# Altium schematic sheet Power_BZ_LED_HD.SchDoc
size A3; SheetNumber: 5; SheetTotal: 6
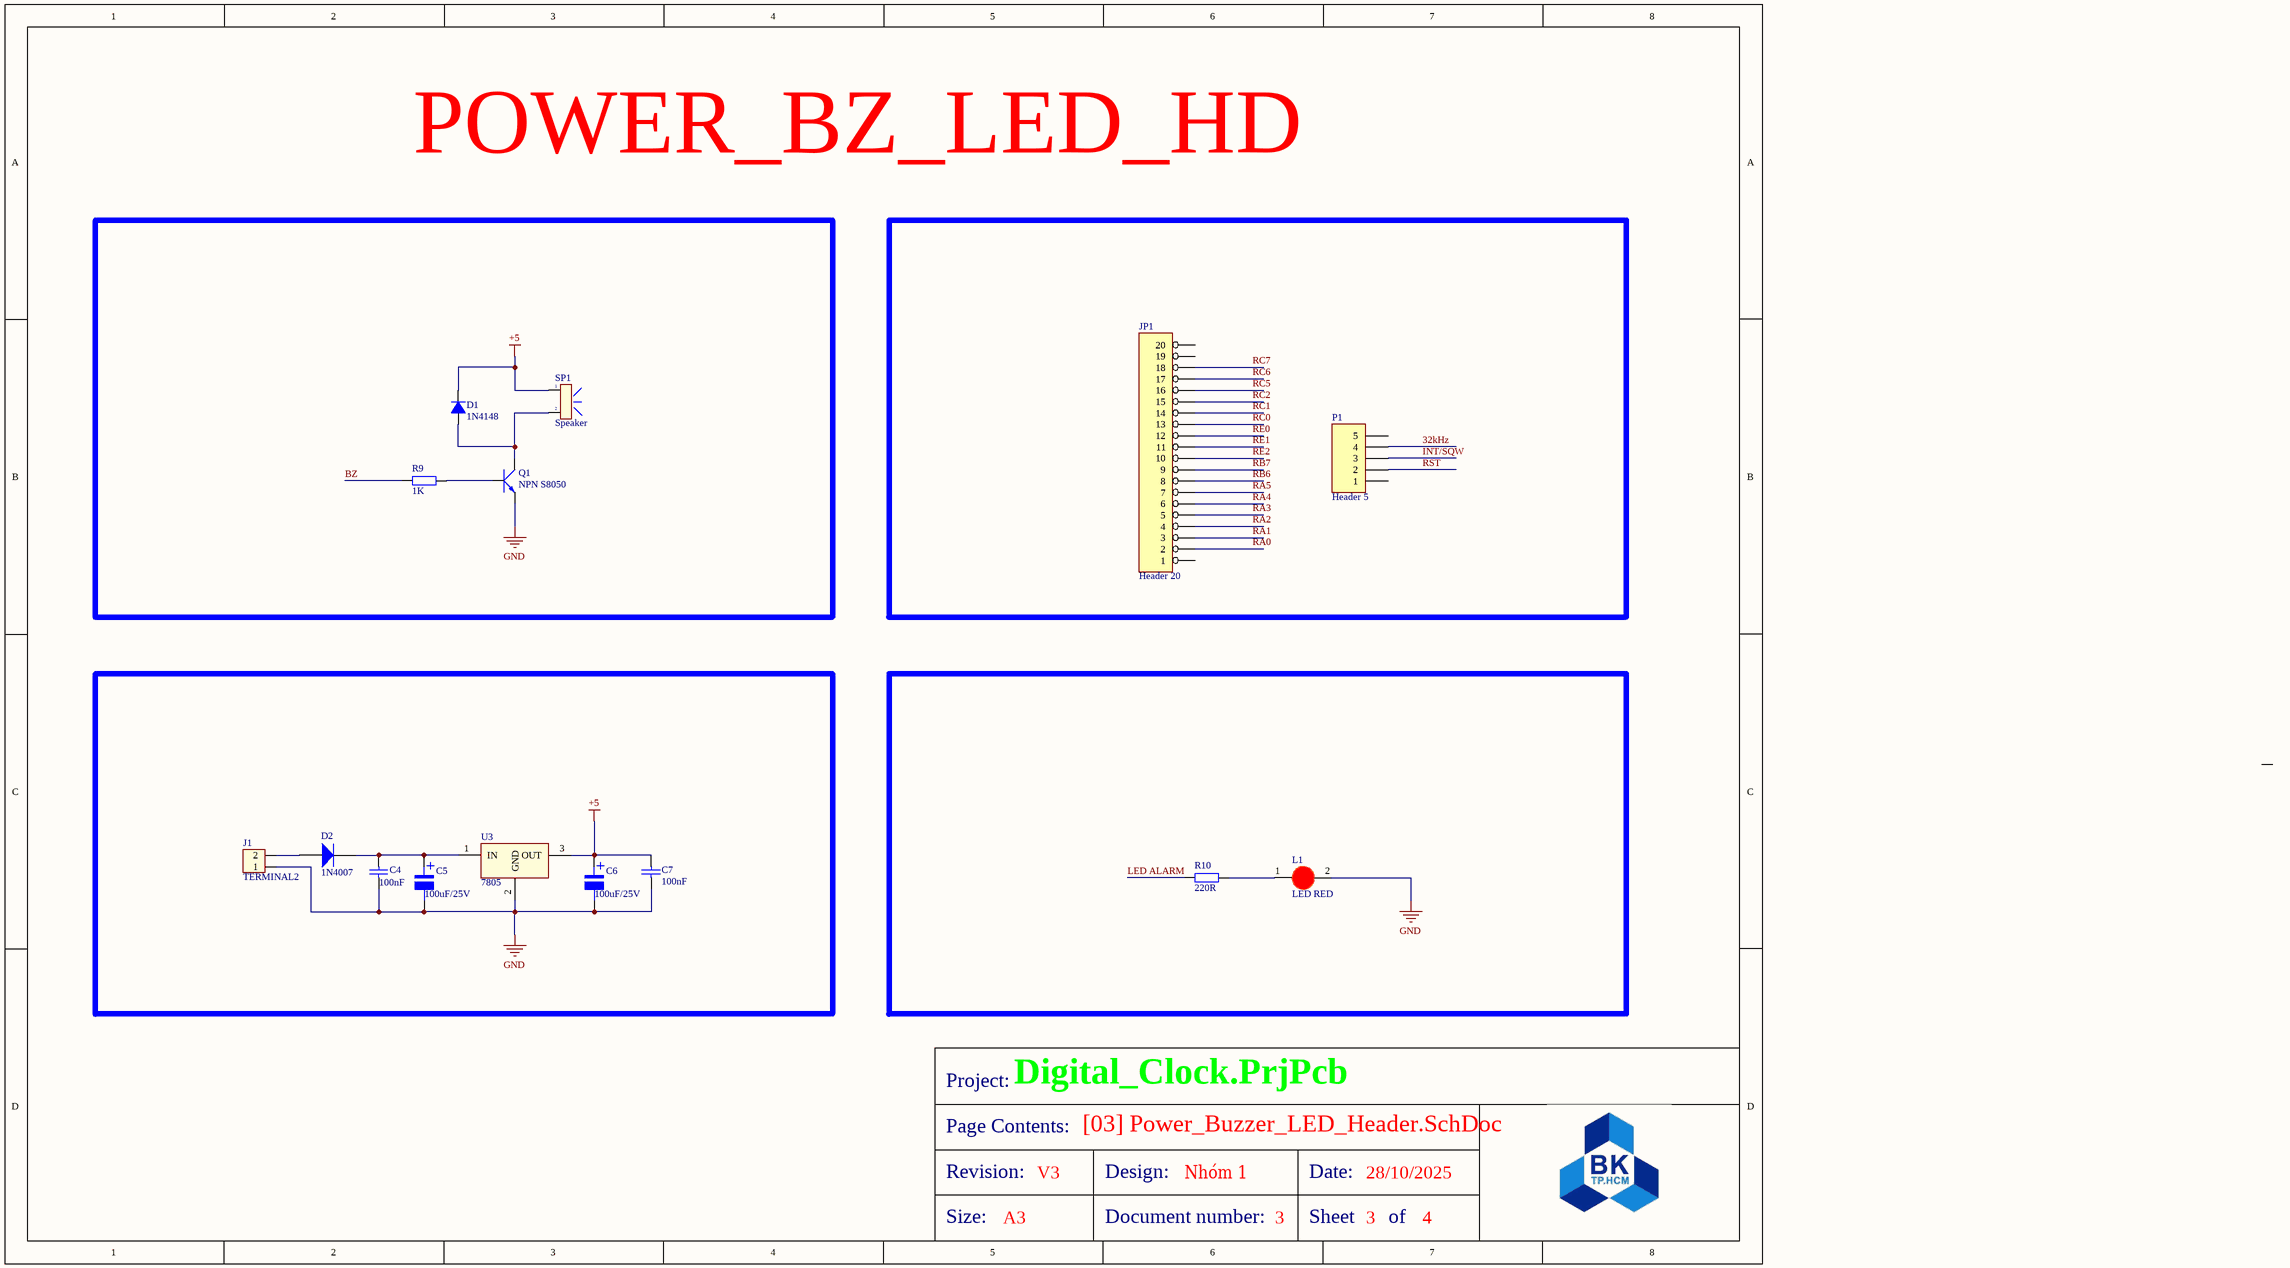
[diagram p0: Power_BZ_LED_HD.SchDoc]

## Parts
C4  100nF  [tu gom]
C5  100uF/25V  [tu nhom 10 (g)]
C6  100uF/25V  [tu nhom 10 (g)]
C7  100nF  [tu gom]
D1  1N4148  [DIODE 0.5A]
D2  1N4007  [DIODE SOD-123]
J1  TERMINAL2  [Header 2P DC 2.54]
JP1  Header 20
L1  LED RED  [LED-5MM-RED]
P1  Header 5
Q1  NPN S8050  [QTO-92]
R9  1K  [tro smd 0603]
R10  220R  [tro vach 1/4w]
SP1  Speaker  [SPK]
U3  7805  [QTO-220]

## Nets
+5: C6.1 C7.1 D1.2(K) SP1.1 U3.3(OUT)
GND: C4.2 C5.2 C6.2 C7.2 J1.1 L1.2(K) Q1.1(E) U3.2(GND)
32kHz: P1.4
BZ: R9.1
INT/SQW: P1.3
LED ALARM: R10.1
RA0: JP1.2
RA1: JP1.3
RA2: JP1.4
RA3: JP1.5
RA4: JP1.6
RA5: JP1.7
RB6: JP1.8
RB7: JP1.9
RC0: JP1.13
RC1: JP1.14
RC2: JP1.15
RC5: JP1.16
RC6: JP1.17
RC7: JP1.18
RE0: JP1.12
RE1: JP1.11
RE2: JP1.10
RST: P1.2
NetC4_1: C4.1 C5.1 D2.2(K) U3.1(IN)
NetD1_1: D1.1(A) Q1.2(C) SP1.2
NetD2_1: D2.1(A) J1.2
NetL1_1: L1.1(A) R10.2
NetQ1_3: Q1.3(B) R9.2

Not connected (* = marked no-connect by the designer): JP1 1 19 20; P1 1 5

## Notes on the sheet
- POWER_BZ_LED_HD
- Project:
- Digital_Clock.PrjPcb
- Page Contents:
- [03] Power_Buzzer_LED_Header.SchDoc
- Revision:
- Size:
- A3
- V3
- Design:
- Document number:
- Nhóm 1
- 3
- Date:
- Sheet
- 28/10/2025
- of
- 4
- (in symbol Tu Nhom 100uF 35V) +

## Library data of the parts
C4 C7 = Tu gom 22pF 50V: Cắm; Don_Vi: Con; So_Chan: 2; Ten_Linh_Kien: Tụ gốm 22P 50V; Ma_Hang: MH004771; Chung_Loai: Cắm; Kieu_Chan: *
C5 C6 = Tu Nhom 100uF 35V: Dán; Don_Vi: Con; Ten_Linh_Kien: Tụ Nhôm 100uF 35V; Ma_Hang: MH004019; So_Chan: 2; Chung_Loai: Dán; Kieu_Chan: *
D1 = Diode 1N4148: Cắm; Ten_Linh_Kien: Diode 1N4148 DO35 450mA 100V ( 1N4148 DIP); Don_Vi: Con; Ma_Hang: MH001065; Ghi Chu: *; Kieu_Chan: *; Chung_Loai: Cắm
D2 = Diode S4: Dán; Ten_Linh_Kien: Diode S4 SOD123 ( 1N5819 SOD123); Ma_Hang: MH005519; Don_Vi: Con; Ghi_Chu: *; Chung_Loai: Dán; Kieu_Chan: *
J1 = Header 2P 2.54 Duc Cong: Cắm; Ten_Linh_Kien: Header 2P XH2.54-2P Đực Cong; Don_Vi: Con; Ma_Hang: MH002852; Chung_Loai: Cắm
JP1 = Header 20: Header, 20-Pin, Right Angle
L1 = LED 5mm Do: Cắm; Don_Vi: Con; Ma_Hang: MH008967; Ten_Linh_Kien: Led 5MM Phủ Đỏ (1000c); Ghi_Chu: *; Kieu_Chan: *; Chung_Loai: Cắm
P1 = Header 5: Header, 5-Pin; LatestRevisionDate: 17-Jul-2002; LatestRevisionNote: Re-released for DXP Platform.; Publisher: Altium Limited
Q1 = NPN_ECB: P 600mW, ECB; Value: C1815
R9 = Tro Vach 1/4W 5% 4.7k: Cắm; Don_Vi: Con; So_Chan: 2; Ten_Linh_Kien: Trở Vạch 1/4w 5% 4.7k; Ma_Hang: MH007317; Chung_Loai: Cắm; Kieu_Chan: *
R10 = Tro Vach 1/4W 5% 220R: Cắm; Don_Vi: Con; So_Chan: 2; Ten_Linh_Kien: Trở Vạch 1/4w 5% 220R; Ma_Hang: MH007300; Chung_Loai: Cắm; Kieu_Chan: *
SP1 = SPK: Speaker Chip; Value: Speaker Chip
U3 = LM78xx: On ap +, from + 5 to + 24VDC; Value: LM7805